# Altium schematic sheet Radio.SchDoc
size A
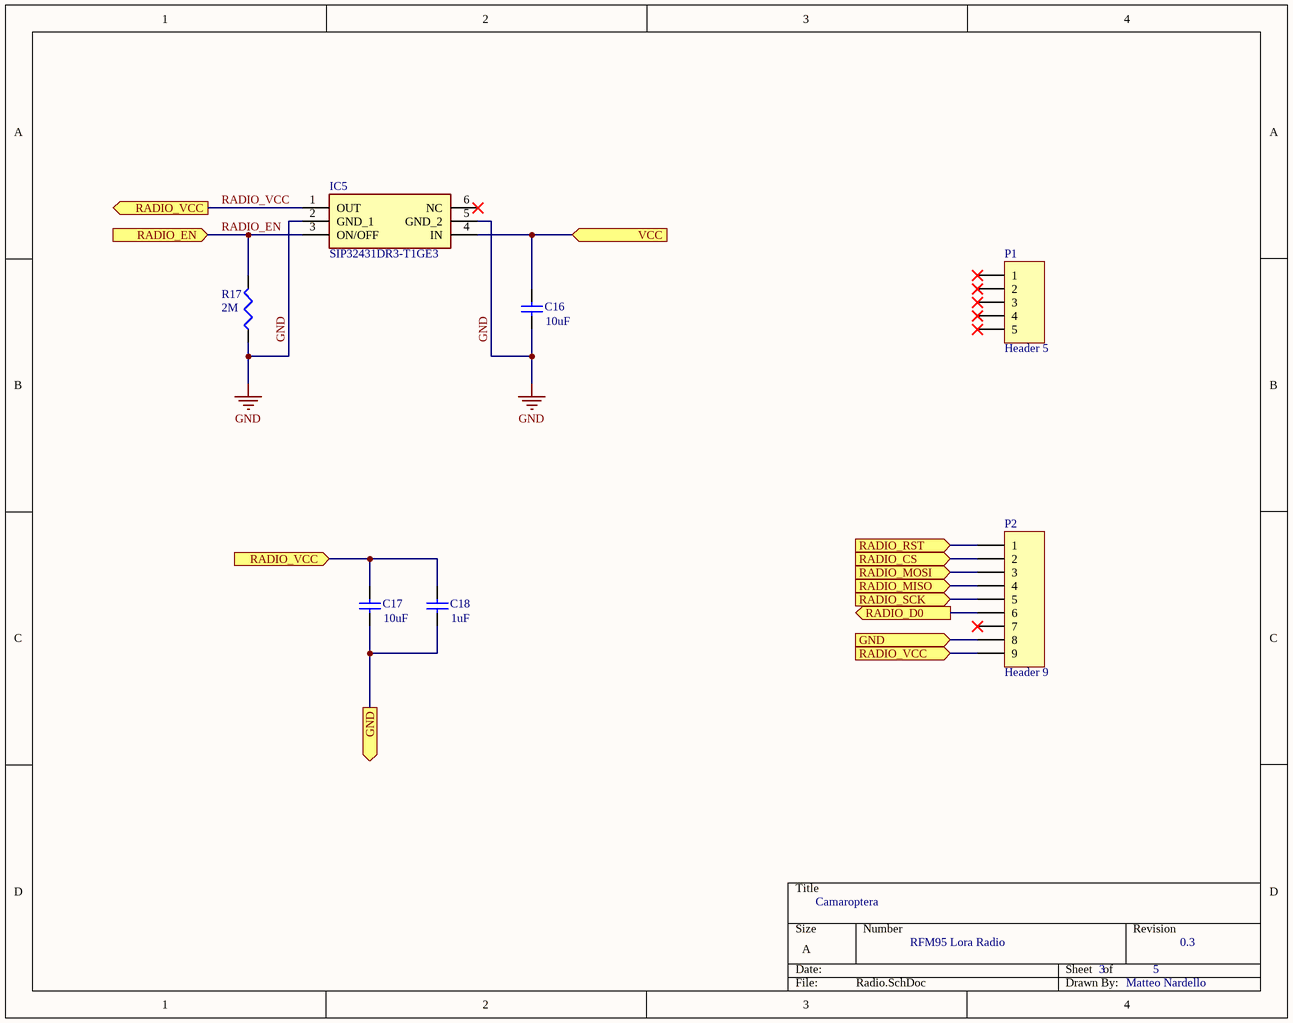
[diagram p0: Radio.SchDoc]

## Parts
C16  value 10uF  [1608[0603]]  (hidden comment: Cap)
C17  value 10uF  [1608[0603]]  (hidden comment: Cap)
C18  value 1uF  [1608[0603]]  (hidden comment: Cap)
IC5  SIP32431DR3-T1GE3  [SOT65P210X110-6N]
P1  Header 5  [HDR1X5]
P2  Header 9  [HDR1X9]
R17  value 2M  [J1-0603]  (hidden comment: Res3)

## Ports
GND (in), GND (out), RADIO_CS (in), RADIO_D0 (out), RADIO_EN (in), RADIO_MISO (in), RADIO_MOSI (in), RADIO_RST (in), RADIO_SCK (in), RADIO_VCC (in), RADIO_VCC (out), VCC (in)

## Nets
GND: C16.1 IC5.2(GND_1) IC5.5(GND_2) R17.1
GND: C17.1 C18.1 P2.8 ; port GND  [a separate net that carries the same name]
RADIO_CS: P2.2 ; port RADIO_CS
RADIO_D0: P2.6 ; port RADIO_D0
RADIO_EN: IC5.3(ON/OFF) R17.2 ; port RADIO_EN
RADIO_MISO: P2.4 ; port RADIO_MISO
RADIO_MOSI: P2.3 ; port RADIO_MOSI
RADIO_RST: P2.1 ; port RADIO_RST
RADIO_SCK: P2.5 ; port RADIO_SCK
RADIO_VCC: C17.2 C18.2 IC5.1(OUT) P2.9 ; port RADIO_VCC
VCC: C16.2 IC5.4(IN) ; port VCC

Not connected (* = marked no-connect by the designer): IC5 6(NC)*; P1 1* 2* 3* 4* 5*; P2 7*

## Notes on the sheet
- Camaroptera
- RFM95 Lora Radio
- 3
- 5
- 0.3
- Matteo Nardello

## Library data of the parts
C16-C18 = Cap: CAP CER 6.3V X5R/X7R 0603; PackageReference: 0603; Publisher: Altium Limited; PackageDescription: Chip Capacitor, Body 1.6x0.8mm, IPC High Density
IC5 = SIP32431DR3-T1GE3: 10 pA, Ultra Low Leakage and Quiescent Current, / Load Switch with Reverse Blocking; Manufacturer_Name: Vishay; Datasheet Link: https://componentsearchengine.com/Datasheets/1/SIP32431DR3-T1GE3.pdf; Height: 1.1mm; Mouser Part Number: 781-SIP32431DR3-GE3; Mouser Price/Stock: https://www.mouser.com/Search/Refine.aspx?Keyword=781-SIP32431DR3-GE3; Manufacturer_Part_Number: SIP32431DR3-T1GE3; ComponentLink1Description: Datasheet; ComponentLink1URL: https://www.vishay.com/docs/66597/sip32431.pdf; ComponentLink2Description: Package Specification; ComponentLink2URL: https://www.vishay.com/docs/71154/71154.pdf; ComponentLink3Description: Manufacturer URL; ComponentLink3URL: https://www.vishay.com
P1 = Header 5: Header, 5-Pin; LatestRevisionDate: 17-Jul-2002; LatestRevisionNote: Re-released for DXP Platform.; Publisher: Altium Limited
P2 = Header 9: Header, 9-Pin; LatestRevisionDate: 17-Jul-2002; LatestRevisionNote: Re-released for DXP Platform.; Publisher: Altium Limited
R17 = Res3: RES 1/10W 1% 0603 SMD; PackageReference: 0603; Publisher: Altium Limited; PackageDescription: Chip Resistor, Body 1.6x0.8mm, IPC High Density